# Altium schematic sheet REGENIX_I2C_MUX.SchDoc
size Tabloid; Date: Date; Author: Author 1; DocumentNumber: 3; Revision: 1; SheetNumber: 4; SheetTotal: 6; Size: 11x17; Sheet_Name: I2C Mux
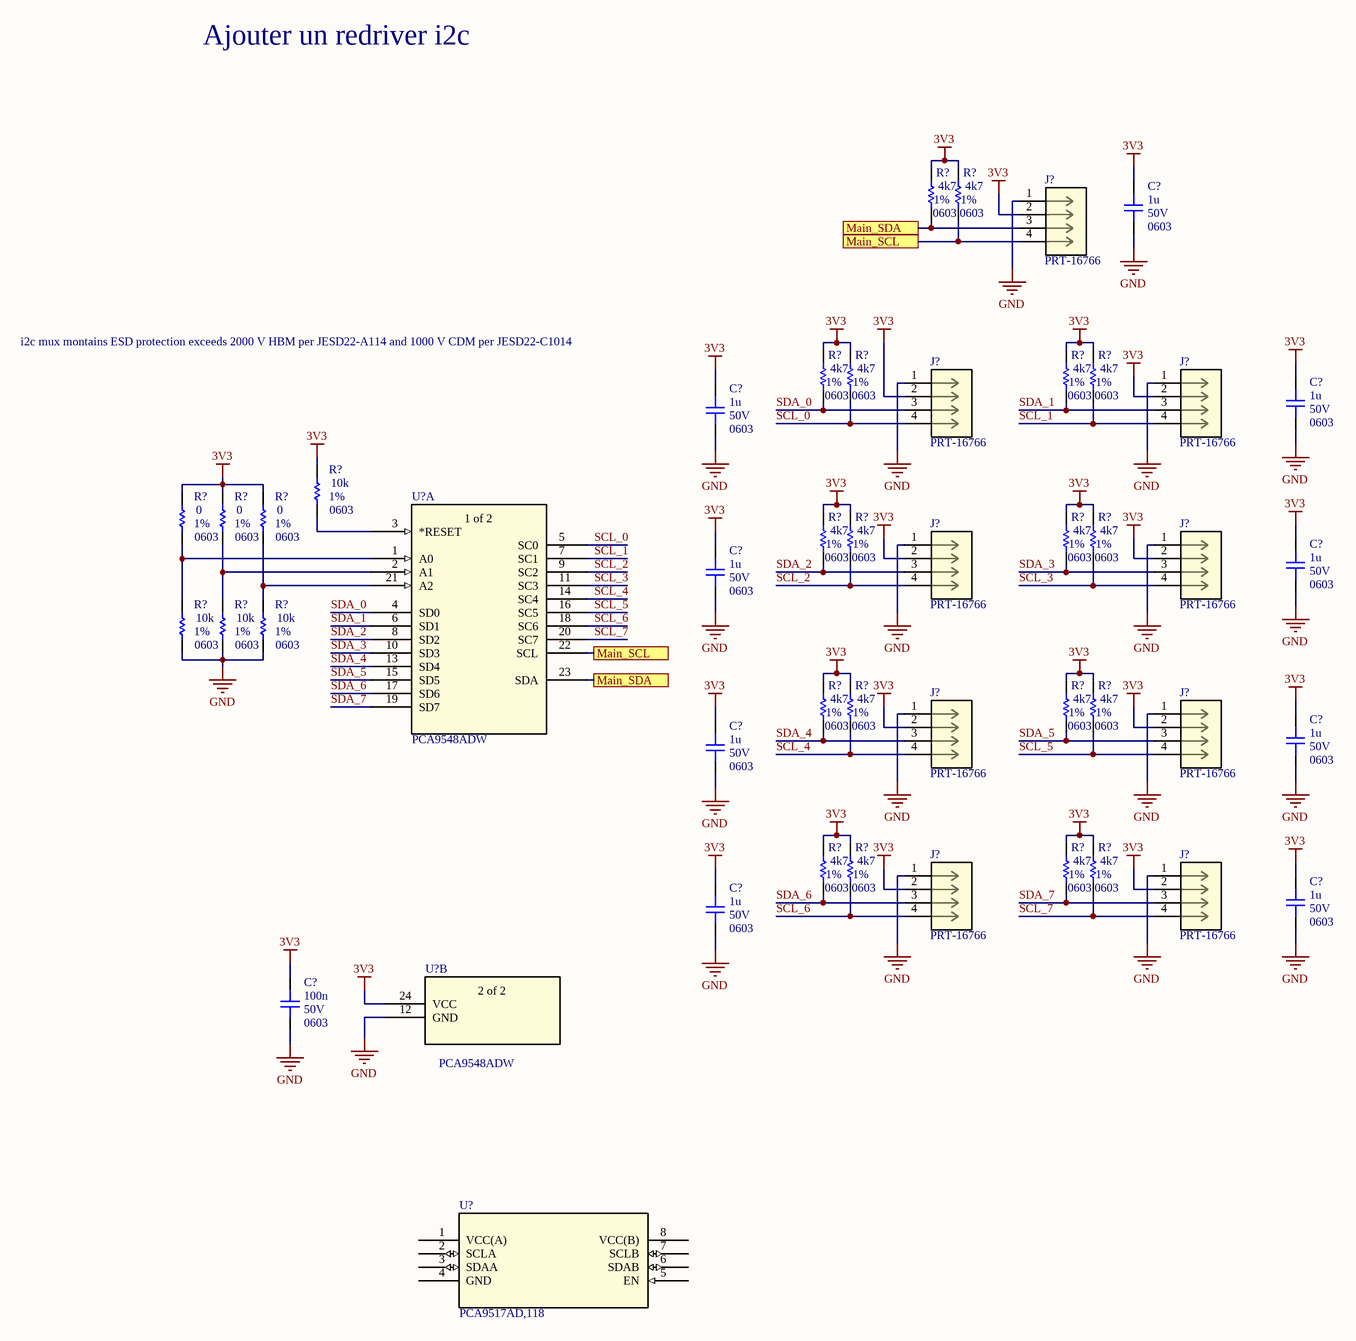
[diagram p0: REGENIX_I2C_MUX.SchDoc]

## Parts
(Parts that share a designator on the sheet are numbered #1, #2 ... from top to bottom, then left to right.)
C?#1  value 1u  Voltage: 50V  Package: 0603  [CAP_0603]  (hidden comment: CAP - 0603)
C?#2  value 1u  Voltage: 50V  Package: 0603  [CAP_0603]  (hidden comment: CAP - 0603)
C?#3  value 1u  Voltage: 50V  Package: 0603  [CAP_0603]  (hidden comment: CAP - 0603)
C?#4  value 1u  Voltage: 50V  Package: 0603  [CAP_0603]  (hidden comment: CAP - 0603)
C?#5  value 1u  Voltage: 50V  Package: 0603  [CAP_0603]  (hidden comment: CAP - 0603)
C?#6  value 1u  Voltage: 50V  Package: 0603  [CAP_0603]  (hidden comment: CAP - 0603)
C?#7  value 1u  Voltage: 50V  Package: 0603  [CAP_0603]  (hidden comment: CAP - 0603)
C?#8  value 1u  Voltage: 50V  Package: 0603  [CAP_0603]  (hidden comment: CAP - 0603)
C?#9  value 1u  Voltage: 50V  Package: 0603  [CAP_0603]  (hidden comment: CAP - 0603)
C?#10  value 100n  Voltage: 50V  Package: 0603  [CAP_0603]  (hidden comment: CAP - 0603)
J?#1  PRT-16766  [CONN_BM04B-SRSS-TB_SPK]
J?#2  PRT-16766  [CONN_BM04B-SRSS-TB_SPK]
J?#3  PRT-16766  [CONN_BM04B-SRSS-TB_SPK]
J?#4  PRT-16766  [CONN_BM04B-SRSS-TB_SPK]
J?#5  PRT-16766  [CONN_BM04B-SRSS-TB_SPK]
J?#6  PRT-16766  [CONN_BM04B-SRSS-TB_SPK]
J?#7  PRT-16766  [CONN_BM04B-SRSS-TB_SPK]
J?#8  PRT-16766  [CONN_BM04B-SRSS-TB_SPK]
J?#9  PRT-16766  [CONN_BM04B-SRSS-TB_SPK]
R?#1  value 4k7  Package: 0603  Precision: 1%  [RES_0603]  (hidden comment: RES - 0603)
R?#2  value 4k7  Package: 0603  Precision: 1%  [RES_0603]  (hidden comment: RES - 0603)
R?#3  value 4k7  Package: 0603  Precision: 1%  [RES_0603]  (hidden comment: RES - 0603)
R?#4  value 4k7  Package: 0603  Precision: 1%  [RES_0603]  (hidden comment: RES - 0603)
R?#5  value 4k7  Package: 0603  Precision: 1%  [RES_0603]  (hidden comment: RES - 0603)
R?#6  value 4k7  Package: 0603  Precision: 1%  [RES_0603]  (hidden comment: RES - 0603)
R?#7  value 10k  Package: 0603  Precision: 1%  [RES_0603]  (hidden comment: RES - 0603)
R?#8  value 0  Package: 0603  Precision: 1%  [RES_0603]  (hidden comment: RES - 0603)
R?#9  value 0  Package: 0603  Precision: 1%  [RES_0603]  (hidden comment: RES - 0603)
R?#10  value 0  Package: 0603  Precision: 1%  [RES_0603]  (hidden comment: RES - 0603)
R?#11  value 4k7  Package: 0603  Precision: 1%  [RES_0603]  (hidden comment: RES - 0603)
R?#12  value 4k7  Package: 0603  Precision: 1%  [RES_0603]  (hidden comment: RES - 0603)
R?#13  value 4k7  Package: 0603  Precision: 1%  [RES_0603]  (hidden comment: RES - 0603)
R?#14  value 4k7  Package: 0603  Precision: 1%  [RES_0603]  (hidden comment: RES - 0603)
R?#15  value 10k  Package: 0603  Precision: 1%  [RES_0603]  (hidden comment: RES - 0603)
R?#16  value 10k  Package: 0603  Precision: 1%  [RES_0603]  (hidden comment: RES - 0603)
R?#17  value 10k  Package: 0603  Precision: 1%  [RES_0603]  (hidden comment: RES - 0603)
R?#18  value 4k7  Package: 0603  Precision: 1%  [RES_0603]  (hidden comment: RES - 0603)
R?#19  value 4k7  Package: 0603  Precision: 1%  [RES_0603]  (hidden comment: RES - 0603)
R?#20  value 4k7  Package: 0603  Precision: 1%  [RES_0603]  (hidden comment: RES - 0603)
R?#21  value 4k7  Package: 0603  Precision: 1%  [RES_0603]  (hidden comment: RES - 0603)
R?#22  value 4k7  Package: 0603  Precision: 1%  [RES_0603]  (hidden comment: RES - 0603)
R?#23  value 4k7  Package: 0603  Precision: 1%  [RES_0603]  (hidden comment: RES - 0603)
R?#24  value 4k7  Package: 0603  Precision: 1%  [RES_0603]  (hidden comment: RES - 0603)
R?#25  value 4k7  Package: 0603  Precision: 1%  [RES_0603]  (hidden comment: RES - 0603)
U?#1  PCA9548ADW  [DW24]  (part A of 2)
U?#2  PCA9548ADW  [DW24]  (part B of 2)
U?#3  PCA9517AD,118  [SO8_SOT96-1_NXP]

## Ports
Main_SCL, Main_SDA

## Nets
3V3: C?#1.2 C?#2.2 C?#3.2 C?#4.2 C?#5.2 C?#6.2 C?#7.2 C?#8.2 C?#9.2 C?#10.2 J?#1.2 J?#2.2 J?#3.2 J?#4.2 J?#5.2 J?#6.2 J?#7.2 J?#8.2 J?#9.2 R?#1.2 R?#2.2 R?#3.2 R?#4.2 R?#5.2 R?#6.2 R?#7.2 R?#8.2 R?#9.2 R?#10.2 R?#11.2 R?#12.2 R?#13.2 R?#14.2 R?#18.2 R?#19.2 R?#20.2 R?#21.2 R?#22.2 R?#23.2 R?#24.2 R?#25.2 U?#2.24(VCC)
GND: C?#1.1 C?#2.1 C?#3.1 C?#4.1 C?#5.1 C?#6.1 C?#7.1 C?#8.1 C?#9.1 C?#10.1 J?#1.1 J?#2.1 J?#3.1 J?#4.1 J?#5.1 J?#6.1 J?#7.1 J?#8.1 J?#9.1 R?#15.1 R?#16.1 R?#17.1 U?#2.12(GND)
Main_SCL: J?#1.4 R?#2.1 U?#1.22(SCL) ; port Main_SCL
Main_SDA: J?#1.3 R?#1.1 U?#1.23(SDA) ; port Main_SDA
SCL_0: J?#2.4 R?#4.1 U?#1.5(SC0)
SCL_1: J?#3.4 R?#6.1 U?#1.7(SC1)
SCL_2: J?#4.4 R?#12.1 U?#1.9(SC2)
SCL_3: J?#5.4 R?#14.1 U?#1.11(SC3)
SCL_4: J?#6.4 R?#19.1 U?#1.14(SC4)
SCL_5: J?#7.4 R?#21.1 U?#1.16(SC5)
SCL_6: J?#8.4 R?#23.1 U?#1.18(SC6)
SCL_7: J?#9.4 R?#25.1 U?#1.20(SC7)
SDA_0: J?#2.3 R?#3.1 U?#1.4(SD0)
SDA_1: J?#3.3 R?#5.1 U?#1.6(SD1)
SDA_2: J?#4.3 R?#11.1 U?#1.8(SD2)
SDA_3: J?#5.3 R?#13.1 U?#1.10(SD3)
SDA_4: J?#6.3 R?#18.1 U?#1.13(SD4)
SDA_5: J?#7.3 R?#20.1 U?#1.15(SD5)
SDA_6: J?#8.3 R?#22.1 U?#1.17(SD6)
SDA_7: J?#9.3 R?#24.1 U?#1.19(SD7)
NetR?#7_1: R?#7.1 U?#1.3(*RESET)
NetR?#8_1: R?#8.1 R?#15.2 U?#1.1(A0)
NetR?#9_1: R?#9.1 R?#16.2 U?#1.2(A1)
NetR?#10_1: R?#10.1 R?#17.2 U?#1.21(A2)

Not connected (* = marked no-connect by the designer): U?#3 1(VCC(A)) 2(SCLA) 3(SDAA) 4(GND) 5(EN) 6(SDAB) 7(SCLB) 8(VCC(B))

## Notes on the sheet
- Ajouter un redriver i2c
- i2c mux montains ESD protection exceeds 2000 V HBM per JESD22-A114 and 1000 V CDM per JESD22-C1014
- Sheet Name
- Project Title
- Global Project
- Revision
- Size
- Date
- Group
- Sheet
- of
- Filename
- Designers
- (in symbol PCA9548ADW, part A) 1 of 2
- (in symbol PCA9548ADW, part B) 2 of 2

## Library data of the parts
C?#1-C?#10 = CAP - 0603: Precision: 10%; Current: *; CreatedBy: Jonathan Bouchard; Power: *
J?#1-J?#9 = PRT-16766: No Description Available; Mfr_Name: Sparkfun; RefDes: RefDes; Type: Type
U?#1 U?#2 = PCA9548ADW: No Description Available; Mfr_Name: Texas Instruments; RefDes: RefDes; Type: Type
U?#3 = PCA9517AD,118: No Description Available; Mfr_Name: NXP; RefDes: RefDes; Type: Type
R?#1-R?#25 = RES - 0603: Current: *; CreatedBy: Jonathan Bouchard